# Altium schematic sheet WL_RFFC.SchDoc
size 594 x 420 mm; SheetNumber: 3; SheetTotal: 9
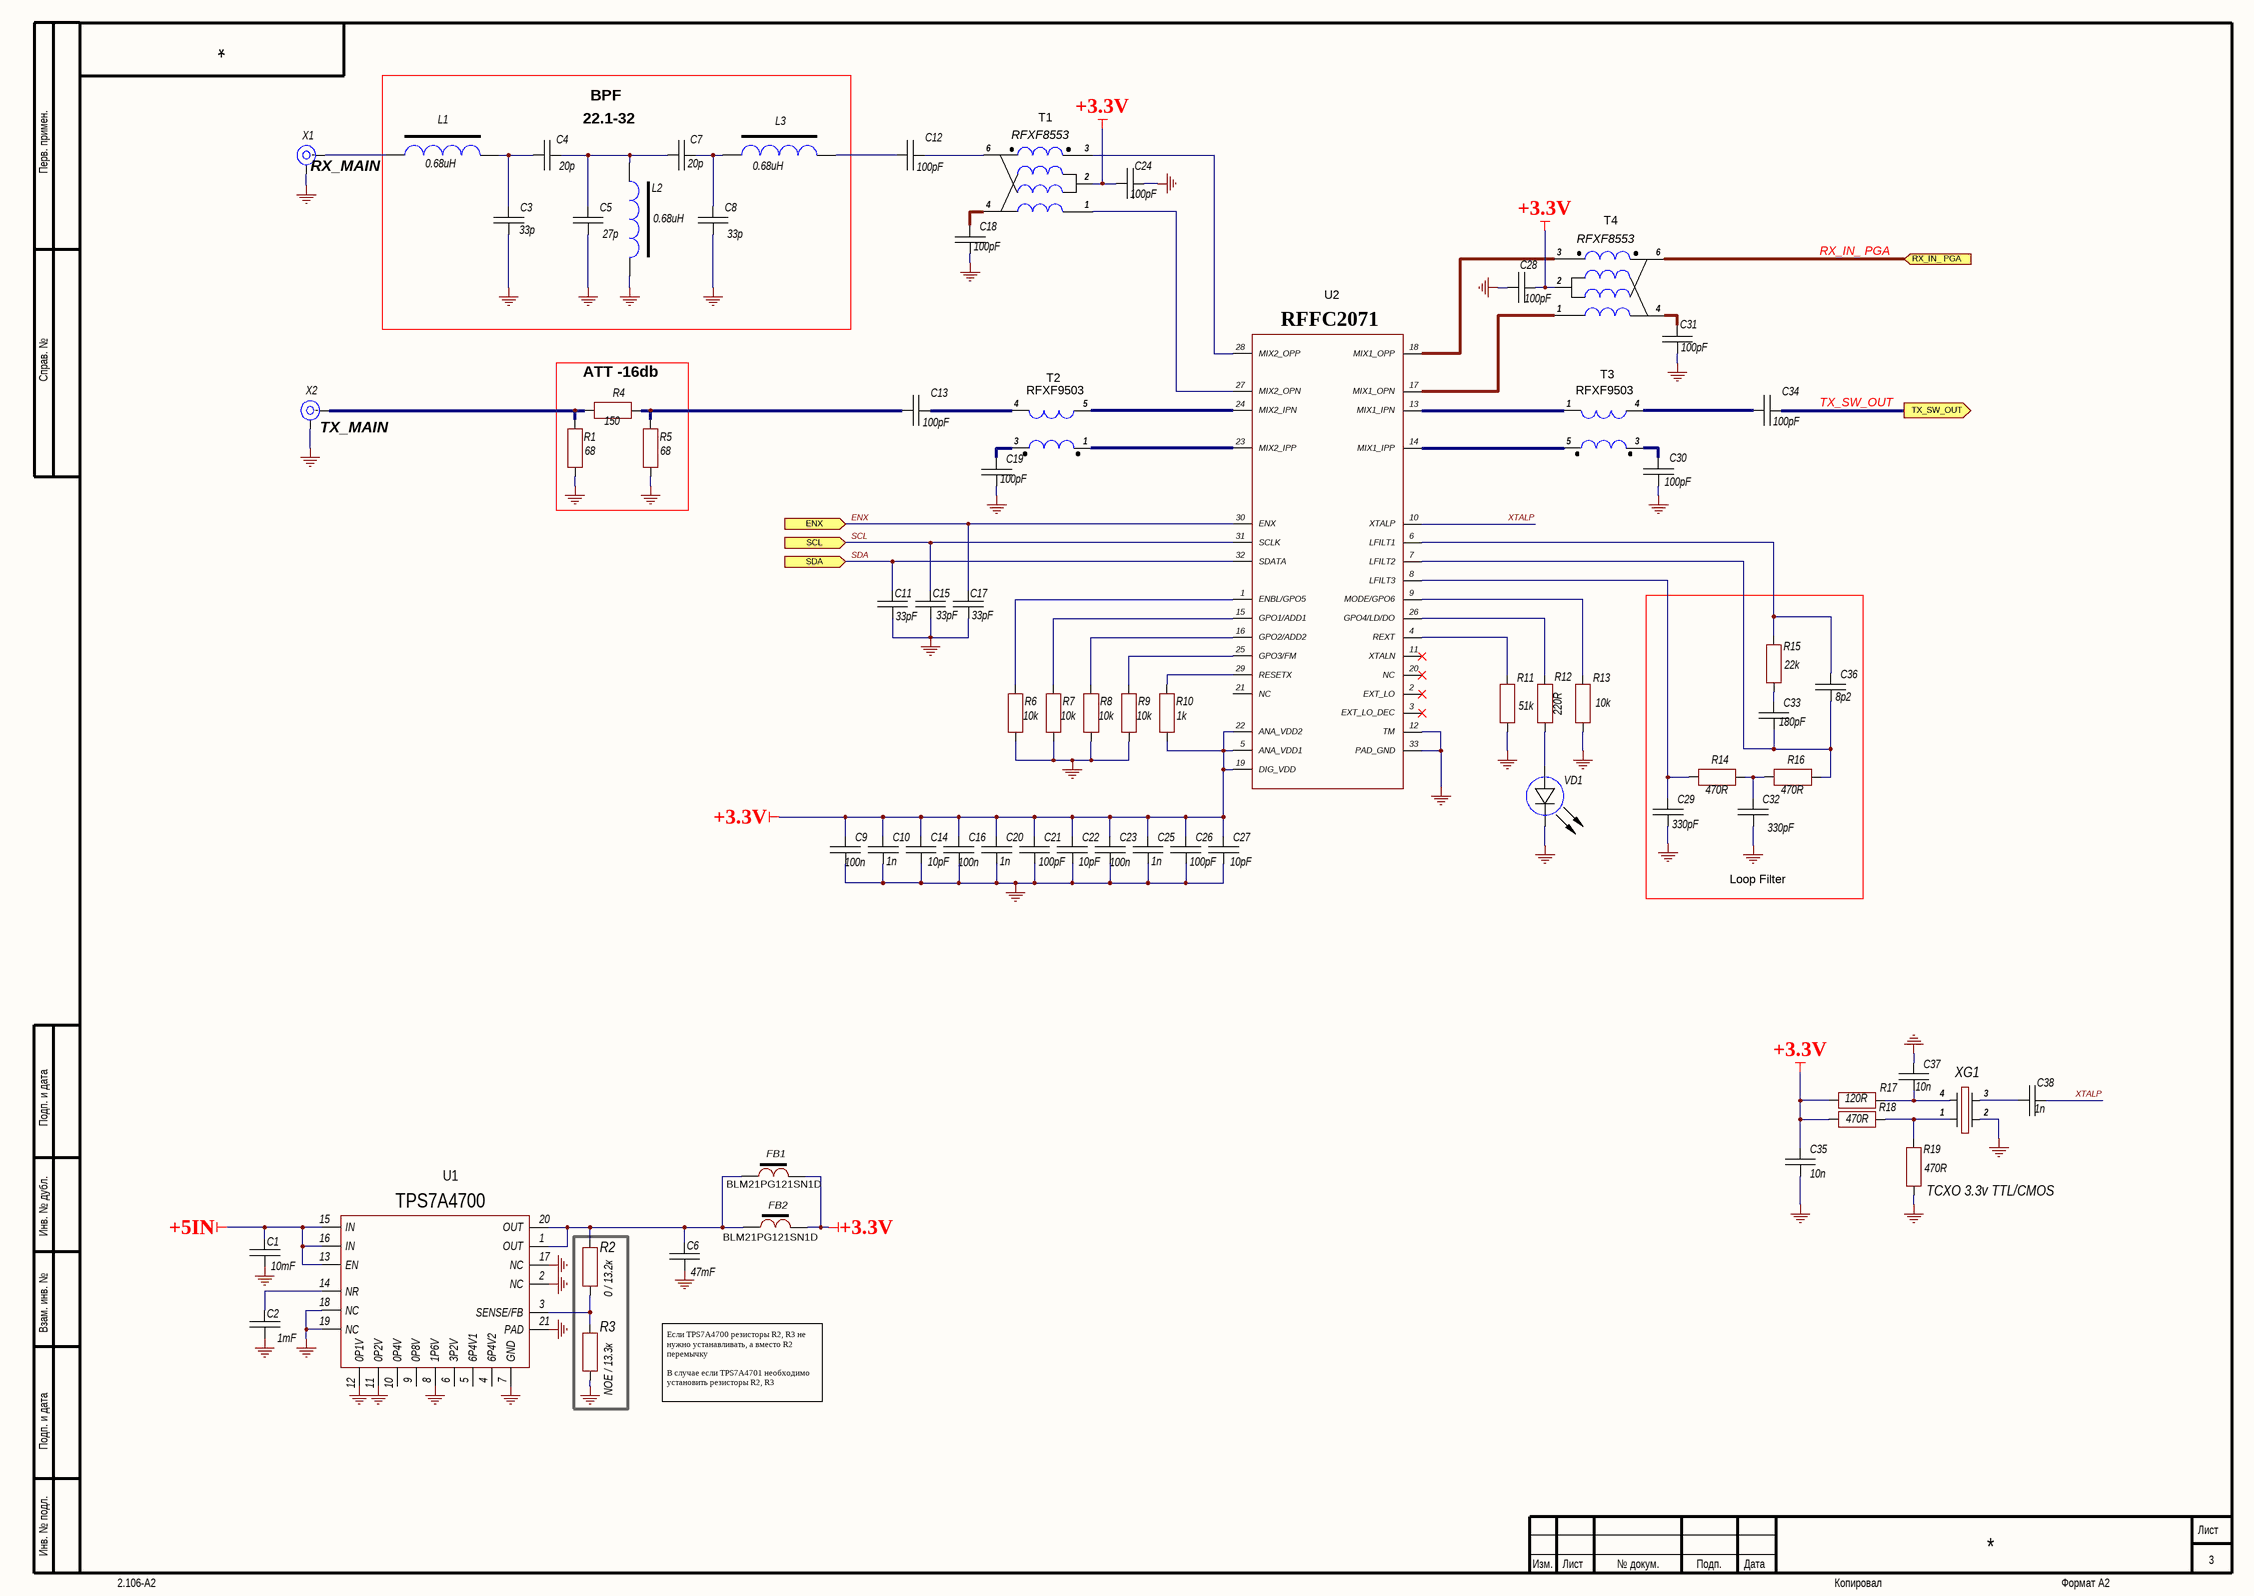
[diagram p0: WL_RFFC.SchDoc]

## Parts
C1  10mF  [CH1206C]
C2  1mF  [CH0805C]
C3  33p  [CH0805C]
C4  20p  [CH0805C]
C5  27p  [CH0805C]
C6  47mF  [CH1206C]
C7  20p  [CH0805C]
C8  33p  [CH0805C]
C9  100n  [CH0805C]
C10  1n  [CH0805C]
C11  33pF  [CH0805C]
C12  100pF  [CH0805C]
C13  100pF  [CH0805C]
C14  10pF  [CH0805C]
C15  33pF  [CH0805C]
C16  100n  [CH0805C]
C17  33pF  [CH0805C]
C18  100pF  [CH0805C]
C19  100pF  [CH0805C]
C20  1n  [CH0805C]
C21  100pF  [CH0805C]
C22  10pF  [CH0805C]
C23  100n  [CH0805C]
C24  100pF  [CH0805C]
C25  1n  [CH0805C]
C26  100pF  [CH0805C]
C27  10pF  [CH0805C]
C28  100pF  [CH0805C]
C29  330pF  [CH0805C]
C30  100pF  [CH0805C]
C31  100pF  [CH0805C]
C32  330pF  [CH0805C]
C33  180pF  [CH0805C]
C34  100pF  [CH0805C]
C35  10n  [CH0805C]
C36  8p2  [CH0805C]
C37  10n  [CH0805C]
C38  1n  [CH0805C]
FB1  BLM21PG121SN1D  [CH0805L]
FB2  BLM21PG121SN1D  [CH0805L]
L1  0.68uH  [L1210]
L2  0.68uH  [L1210]
L3  0.68uH  [L1210]
R1  68  [CH1206R]
R2  0 / 13.2к  [CH0805R]
R3  NOE / 13.3к  [CH0805R]
R4  150  [CH1206R]
R5  68  [CH1206R]
R6  10k  [CH0805R]
R7  10k  [CH0805R]
R8  10k  [CH0805R]
R9  10k  [CH0805R]
R10  1k  [CH0805R]
R11  51k  [CH0805R]
R12  220R  [CH0805R]
R13  10k  [CH0805R]
R14  470R  [CH0805R]
R15  22k  [CH0805R]
R16  470R  [CH0805R]
R17  120R  [CH0805R]
R18  470R  [CH0805R]
R19  470R  [CH0805R]
T1  RFXF8553  [TC4-1-ADT4-6]
T2  RFXF9503  [TC4-1/RFXF8553]
T3  RFXF9503  [TC4-1/RFXF8553]
T4  RFXF8553  [TC4-1-ADT4-6]
U1  TPS7A4700  [20-VQFN (5x5 mm)]
U2  RFFC2071  [32-VQFN (5x5 mm)]
VD1  *  [CH0805LB]  (value not drawn)
X1  RX_MAIN  [CON: SMA]
X2  TX_MAIN  [CON: SMA]
XG1  TCXO 3.3v TTL/CMOS  [TCXO]

## Blocks framed on the sheet
ATT -16db: R1 R4 R5
Loop Filter: C29 C32 C33 C36 R14-R16

## Ports
ENX (in), RX_IN_ PGA (in), SCL (in), SDA (in), TX_SW_OUT (out)

## Nets
+3.3V: C9.2 C10.2 C14.2 C16.2 C20.2 C21.2 C22.2 C23.2 C24.2 C25.2 C26.2 C27.2 C28.2 C35.2 FB1.2 FB2.2 R10.2 R17.1 R18.1 T1.2 T4.2 U2.5(ANA_VDD1) U2.19(DIG_VDD) U2.22(ANA_VDD2)
+5IN: C1.2 U1.13(EN) U1.15(IN) U1.16(IN)
GND: C1.1 C2.1 C3.1 C5.1 C6.1 C8.1 C9.1 C10.1 C11.1 C14.1 C15.1 C16.1 C17.1 C18.2 C19.2 C20.1 C21.1 C22.1 C23.1 C24.1 C25.1 C26.1 C27.1 C28.1 C29.1 C30.2 C31.2 C32.1 C35.1 C37.2 L2.1 R1.2 R3.1 R5.2 R6.2 R7.2 R8.2 R9.2 R11.2 R13.2 R19.1 U1.2(NC) U1.7(GND) U1.8(1P6V) U1.11(0P2V) U1.12(0P1V) U1.17(NC) U1.18(NC) U1.19(NC) U1.21(PAD) U2.12(TM) U2.33(PAD_GND) VD1.2(C) X1.2(IN) X2.2(IN) XG1.2
ENX: C17.2 U2.30(ENX) ; port ENX
RX_IN_ PGA: T4.6 ; port RX_IN_ PGA
SCL: C15.2 U2.31(SCLK) ; port SCL
SDA: C11.2 U2.32(SDATA) ; port SDA
TX_SW_OUT: C34.1 ; port TX_SW_OUT
XTALP: C38.1 U2.10(XTALP)
NetC2_2: C2.2 U1.14(NR)
NetC3_2: C3.2 C4.1 L1.2
NetC4_2: C4.2 C5.2 C7.1 L2.2
NetC6_2: C6.2 FB1.1 FB2.1 R2.2 U1.1(OUT) U1.20(OUT)
NetC7_2: C7.2 C8.2 L3.1
NetC12_1: C12.1 L3.2
NetC12_2: C12.2 T1.6
NetC13_1: C13.1 R4.2 R5.1
NetC13_2: C13.2 T2.4
NetC18_1: C18.1 T1.4
NetC19_1: C19.1 T2.3
NetC29_2: C29.2 R14.1 U2.8(LFILT3)
NetC30_1: C30.1 T3.3
NetC31_1: C31.1 T4.4
NetC32_2: C32.2 R14.2 R16.1
NetC33_1: C33.1 C36.1 R16.2 U2.7(LFILT2)
NetC33_2: C33.2 R15.1
NetC34_2: C34.2 T3.4
NetC36_2: C36.2 R15.2 U2.6(LFILT1)
NetC37_1: C37.1 R17.2 XG1.4
NetC38_2: C38.2 XG1.3
NetL1_1: L1.1 X1.1(IN)
NetR1_1: R1.1 R4.1 X2.1(IN)
NetR2_1: R2.1 R3.2 U1.3(SENSE/FB)
NetR6_1: R6.1 U2.1(ENBL/GPO5)
NetR7_1: R7.1 U2.15(GPO1/ADD1)
NetR8_1: R8.1 U2.16(GPO2/ADD2)
NetR9_1: R9.1 U2.25(GPO3/FM)
NetR10_1: R10.1 U2.29(RESETX)
NetR11_1: R11.1 U2.4(REXT)
NetR12_1: R12.1 U2.26(GPO4/LD/DO)
NetR12_2: R12.2 VD1.1(A)
NetR13_1: R13.1 U2.9(MODE/GPO6)
NetR18_2: R18.2 R19.2 XG1.1
NetT1_1: T1.1 U2.27(MIX2_OPN)
NetT1_3: T1.3 U2.28(MIX2_OPP)
NetT2_1: T2.1 U2.23(MIX2_IPP)
NetT2_5: T2.5 U2.24(MIX2_IPN)
NetT3_1: T3.1 U2.13(MIX1_IPN)
NetT3_5: T3.5 U2.14(MIX1_IPP)
NetT4_1: T4.1 U2.17(MIX1_OPN)
NetT4_3: T4.3 U2.18(MIX1_OPP)

Not connected (* = marked no-connect by the designer): U1 4(6P4V2) 5(6P4V1) 6(3P2V) 9(0P8V) 10(0P4V); U2 2(EXT_LO)* 3(EXT_LO_DEC)* 11(XTALN)* 20(NC)* 21(NC)

## Notes on the sheet
- BPF
- 22.1-32
- Если TPS7A4700 резисторы R2, R3 не нужно устанавливать, а вместо R2 перемычку
  В случае если TPS7A4701 необходимо установить резисторы R2, R3
- Перв. примен.
- Справ. №
- Подп. и дата
- Инв. № дубл.
- Взам. инв. №
- Инв. № подл.
- Изм.
- Лист
- № докум.
- Подп.
- Дата
- 2.106-A2
- Копировал
- Формат А2

## Library data of the parts
C1-C38 = Capacitor: Manufacturer: *; Model: *; HelpURL: *; ComponentKind: *; Value: *
FB1 FB2 = FB-1
L1-L3 = TRANS
R1-R19 = Resistor: Manufacturer: *; Model: *; HelpURL: *; ComponentKind: *; Value: *
VD1 = LED: Manufacturer: *; Model: *; HelpURL: *; ComponentKind: *; Value: *
X1 X2 = SMA: RF; Model: *; Manufacturer: *; HelpURL: *; ComponentKind: *
XG1 = Generator: Manufacturer: *; Model: *; HelpURL: *; ComponentKind: *; Value: *